# Altium schematic sheet accelerator.SchDoc
size A
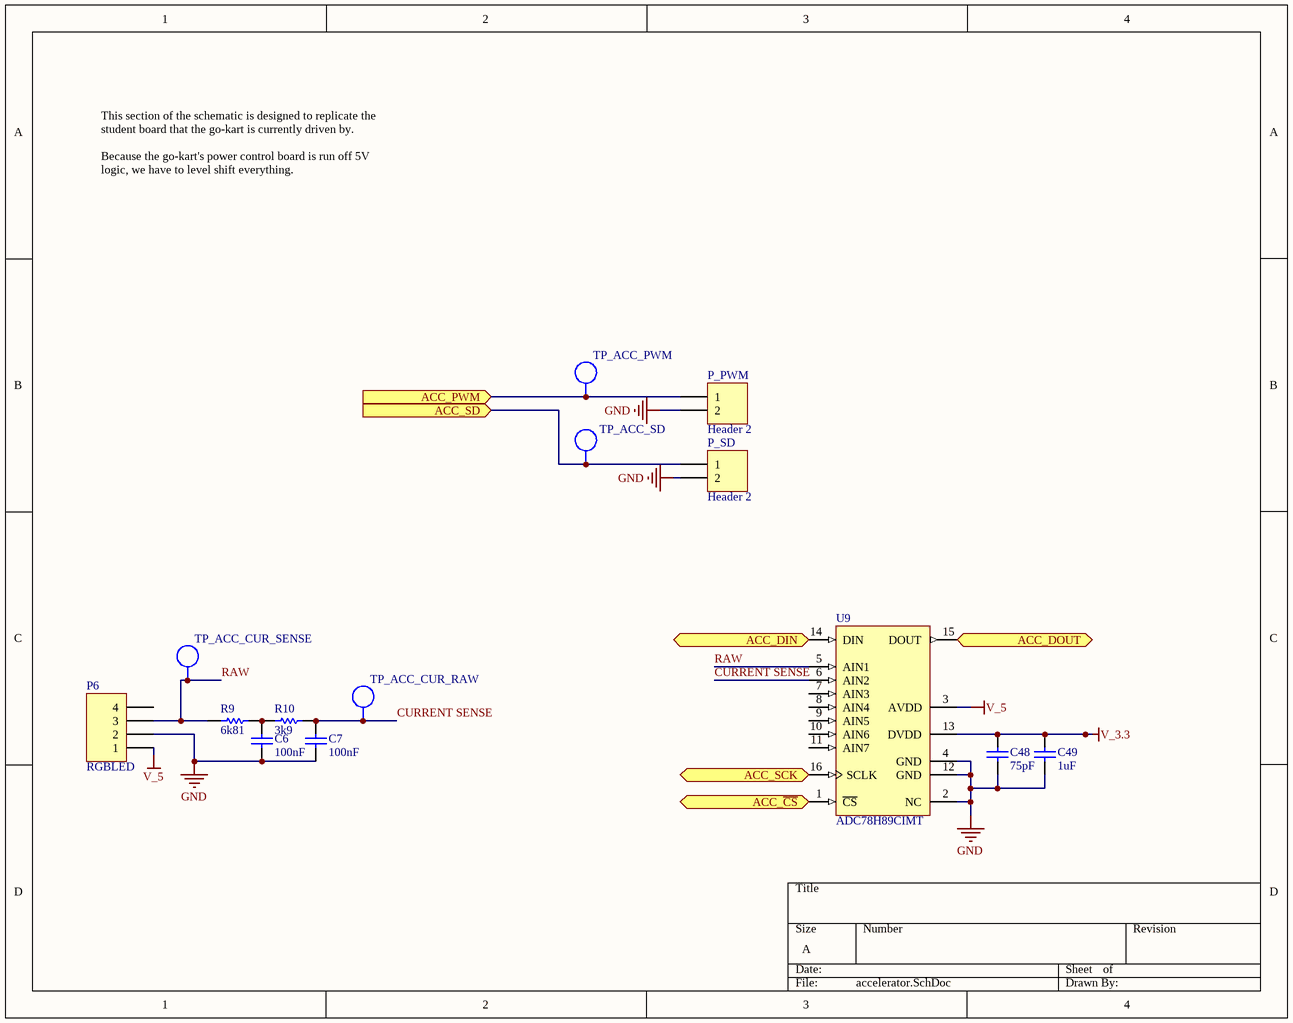
[diagram p0: accelerator.SchDoc]

## Parts
C6  100nF  [0603]
C7  100nF  [0603]
C48  value 75pF  [0603]  (hidden comment: CP_75pF 0603)
C49  1uF  [0603]
P6  RGBLED  [HDR1X4]
P_PWM  Header 2  [HDR1X2]
P_SD  Header 2  [HDR1X2]
R9  6k81  [0603]
R10  3k9  [0603]
TP_ACC_CUR_RAW  TP  [TEST_POINT_4X2MM]  (value not drawn)  (no BOM)
TP_ACC_CUR_SENSE  TP  [TEST_POINT_4X2MM]  (value not drawn)  (no BOM)
TP_ACC_PWM  TP  [TEST_POINT_4X2MM]  (value not drawn)  (no BOM)
TP_ACC_SD  TP  [TEST_POINT_4X2MM]  (value not drawn)  (no BOM)
U9  ADC78H89CIMT  [MTC16_N]

## Ports
ACC_DIN (in), ACC_DOUT (out), ACC_PWM (in), ACC_SCK (in), ACC_SD (in), ACC_~{CS} (in)

## Nets
GND: C6.1 C7.1 C48.1 C49.1 P6.2 P_PWM.2 P_SD.2 U9.2(NC) U9.4(GND) U9.12(GND)
V_3.3: C48.2 C49.2 U9.13(DVDD)
V_5: P6.1 U9.3(AVDD)
ACC_~{CS}: U9.1(~{CS}) ; port ACC_~{CS}
ACC_DIN: U9.14(DIN) ; port ACC_DIN
ACC_DOUT: U9.15(DOUT) ; port ACC_DOUT
ACC_PWM: P_PWM.1 TP_ACC_PWM.1 ; port ACC_PWM
ACC_SCK: U9.16(SCLK) ; port ACC_SCK
ACC_SD: P_SD.1 TP_ACC_SD.1 ; port ACC_SD
CURRENT SENSE: C7.2 R10.2 TP_ACC_CUR_RAW.1 U9.6(AIN2)
RAW: P6.3 R9.1 TP_ACC_CUR_SENSE.1 U9.5(AIN1)
NetC6_2: C6.2 R9.2 R10.1

Not connected (* = marked no-connect by the designer): P6 4; U9 7(AIN3) 8(AIN4) 9(AIN5) 10(AIN6) 11(AIN7)

## Notes on the sheet
- This section of the schematic is designed to replicate the student board that the go-kart is currently driven by.
  Because the go-kart's power control board is run off 5V logic, we have to level shift everything.

## Library data of the parts
C6 C7 = CP_100nF 0603: CAP CER .10UF 50V X5R 0603; Manufacturer: Taiyo Yuden; Manufacturer PN: UMK107B7104KA-T; LatestRevisionDate: 29 May 08; Supplier 1: Digi-Key; Supplier Part Number 1: 478-6206-1-ND; Value: 100nF; Part Number: CP_100nF 0603; Component Kind: Standard; Component Type: Standard; Designator: CP_100nF 0603; Pin Count: 2; Signal Integrity: Cap; Simulation: CAP
C48 = CP_75pF 0603: CAP CER 75PF 50V 5% C0G 0603; Manufacturer: Murata Electronics; Manufacturer PN: GRM1885C1H750JA01D; LatestRevisionDate: 29 May 08; Supplier 1: Digi-Key; Supplier Part Number 1: 490-1424-2-ND; Part Number: CP_75pF 0603; Component Kind: Standard; Component Type: Standard; Designator: CP_75pF 0603; Pin Count: 2; Signal Integrity: Cap; Simulation: CAP
C49 = CP_1uF_50V_0603: CAP CER 1.0UF 50V X7R 0603; Manufacturer: Taiyo Yuden; Manufacturer PN: UMK107C5105KA-T; Supplier Part Number 1: 445-5090-2-ND; Supplier 1: Digi-Key; Value: 1uF; Part Number: CP_1uF_50V_0603; Component Kind: Standard; Component Type: Standard; Designator: CP_1uF_50V_0603; Pin Count: 2; Signal Integrity: Cap; Simulation: CAP
P6 = Header 4: Header, 4-Pin; LatestRevisionDate: 17-Jul-2002; LatestRevisionNote: Re-released for DXP Platform.; Publisher: Altium Limited; Supplier 1: ECE Store
P_PWM P_SD = Header 2: Header, 2-Pin; LatestRevisionDate: 17-Jul-2002; LatestRevisionNote: Re-released for DXP Platform.; Publisher: Altium Limited; Supplier 1: ECE Store
R9 = RS_6k81_0603: RES 6k81 OHM 1/10W 1% 0603 SMD; Manufacturer: Rohm; Manufacturer PN: MCR03EZPFX6811; Verify: Not Checked; LatestRevisionDate: 24 Feb 09; Supplier 1: Digi-Key; Supplier Part Number 1: RHM6.81KHTR-ND; Value: 6k81; Part Number: RS_6k81_0603; Component Kind: Standard; Component Type: Standard; Designator: RS_6k81_0603; Pin Count: 2; Signal Integrity: Res; Simulation: RESISTOR
R10 = RS_3k9 0603: RES 3.9K OHM 1/10W 5% 0603 SMD; Manufacturer: Yageo; Manufacturer PN: RC0603JR-073K9L; LatestRevisionDate: 6 May 2011; Supplier 1: Digi-Key; Supplier Part Number 1: 311-3.9KGRTR-ND; Value: 3k9; Part Number: RS_3k9 0603; Component Kind: Standard; Component Type: Standard; Designator: RS_3k9 0603; Pin Count: 2; Signal Integrity: Res; Simulation: RESISTOR
TP_ACC_CUR_RAW TP_ACC_CUR_SENSE TP_ACC_PWM TP_ACC_SD = TP_TESTPOINT: Test-Point; LatestRevisionDate: 29 May 08; Manufacturer PN: *; Manufacturer: *; Supplier 1: Digi-Key; Supplier Part Number 1: 5016KTR-ND; Value: TP; Part Number: TP_TESTPOINT; Component Type: Standard (No BOM); Designator: TP_TESTPOINT; Pin Count: 1
U9 = ADC78H89CIMT: 7-Channel, 500 KSPS, 12-Bit A/D Converter; Manufacturer: National Semiconductor; CompType: ADC IC; PackageTopMarking: NSUZXYTT*78H89*CIMT; PowerWise: Y; Published: 4-Dec-2008; DatasheetVersion: Apr-2003; PackageVersion: revD, Jun-2003; PackageReference: MTC16; Publisher: Altium Limited; PackageDescription: Molded TSSOP, Jedec, 5 x 4.4 x 0.9mm Body, 16 Lead, 0.65mm Pitch; PartNumber: ADC78H89CIMT; RoHS: O; PinCount: 16; DigiKeyPartNumber: ADC78H89CIMT-ND; Code_JEDEC: MO-153-AB; ComponentLink1Description: ADC78H89 Datasheet; ComponentLink1URL: http://www.national.com/ds/AD/ADC78H89.pdf; ComponentLink2Description: ADC78H89 Web Page; ComponentLink2URL: http://www.national.com/pf/AD/ADC78H89.html; ComponentLink3Description: MTC16 Package Page; ComponentLink3URL: http://www.national.com/packaging/folders/mtc16.html; Supplier 1: Digi-Key; Supplier Part Number 1: ADC78H89CIMT-ND